# Altium project Wheel_Encoder_Project.PrjPcb
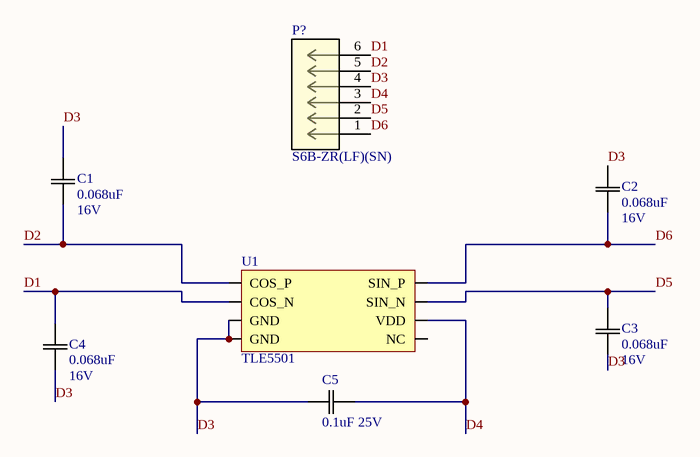
[diagram p0: Wheel_Encoder_Board_Schematic1.SchDoc]
1 sheet, 7 parts. Net scope: global (net labels, ports and power ports of the same name join across sheets).
Board files: Wheel_Encoder_PCB.PcbDoc, Wheel_Encoder_PCB2.PcbDoc, Wheel_Encoder_PCB3.PcbDoc, Wheel_Encoder_PCB_Final.PcbDoc

## Sheet Wheel_Encoder_Board_Schematic1.SchDoc
size E

### Parts
C1  Rating: 16V  [0603]  (hidden comment: 0.068uF)
C2  Rating: 16V  [0603]  (hidden comment: 0.068uF)
C3  Rating: 16V  [0603]  (hidden comment: 0.068uF)
C4  Rating: 16V  [0603]  (hidden comment: 0.068uF)
C5  0.1uF 25V  [0805]
P?  S6B-ZR(LF)(SN)  [S6B-ZR_JST]
U1  TLE5501  [8-SOIC]

### Nets
D1: C4.2(C2) P?.6 U1.2(COS_N)
D2: C1.1(C1) P?.5 U1.1(COS_P)
D3: C1.2(C2) C2.2(C2) C3.1(C1) C4.1(C1) C5.1(C1) P?.4 U1.3(GND) U1.4(GND)
D4: C5.2(C2) P?.3 U1.6(VDD)
D5: C3.2(C2) P?.2 U1.7(SIN_N)
D6: C2.1(C1) P?.1 U1.8(SIN_P)

Not connected (* = marked no-connect by the designer): U1 5(NC)

### Library data of the parts
C1-C4 = CAP 0.068uF 16V: CAP CER 0.068UF 16V X5R 0603/0805; Tolerance: 10%; Package: 0603/0805; Temperature Coefficient: X5R; Operating Temperature: -55°C ~ 85°C; Value: 0.068uF
C5 = CAP 0.1uF 25V: CAP CER 0.1UF 25V X7R 0805; Tolerance: 10%; Value: 0.1uF; Temperature Coefficient: X7R; Rating: 25V; Operating Temperature: -55°C ~ 125°C
P? = S6B-ZR(LF)(SN): No Description Available; Vendor: JST; Built_By: EMA_UL_Team; SourceLibrary: JST_2017-04-18; Manufacturer_Part_Number: S6B-ZR(LF)(SN); Copyright: Copyright (C) 2018 Accelerated Designs. All rights reserved; RefDes: RefDes; Type: DEV
U1 = TLE5501: TMR 360deg Magnetic Encoder; Manufacturer: Infineon Technologies; Manufacturer Part Number: TLE5501E0001XUMA1; Digi-Key Part Number: TLE5501E0001XUMA1DKR-ND; Package: PG-DSO-8-16; Supplier 1: Digi-Key; Supplier Part Number 1: TLE5501E0001XUMA1CT-ND